# Altium schematic sheet IP5568-MCU-188-3LED-ACL-V1.0.SchDoc
size 500 x 299 mm; DocumentNumber: 5; SheetNumber: 5; SheetTotal: 8
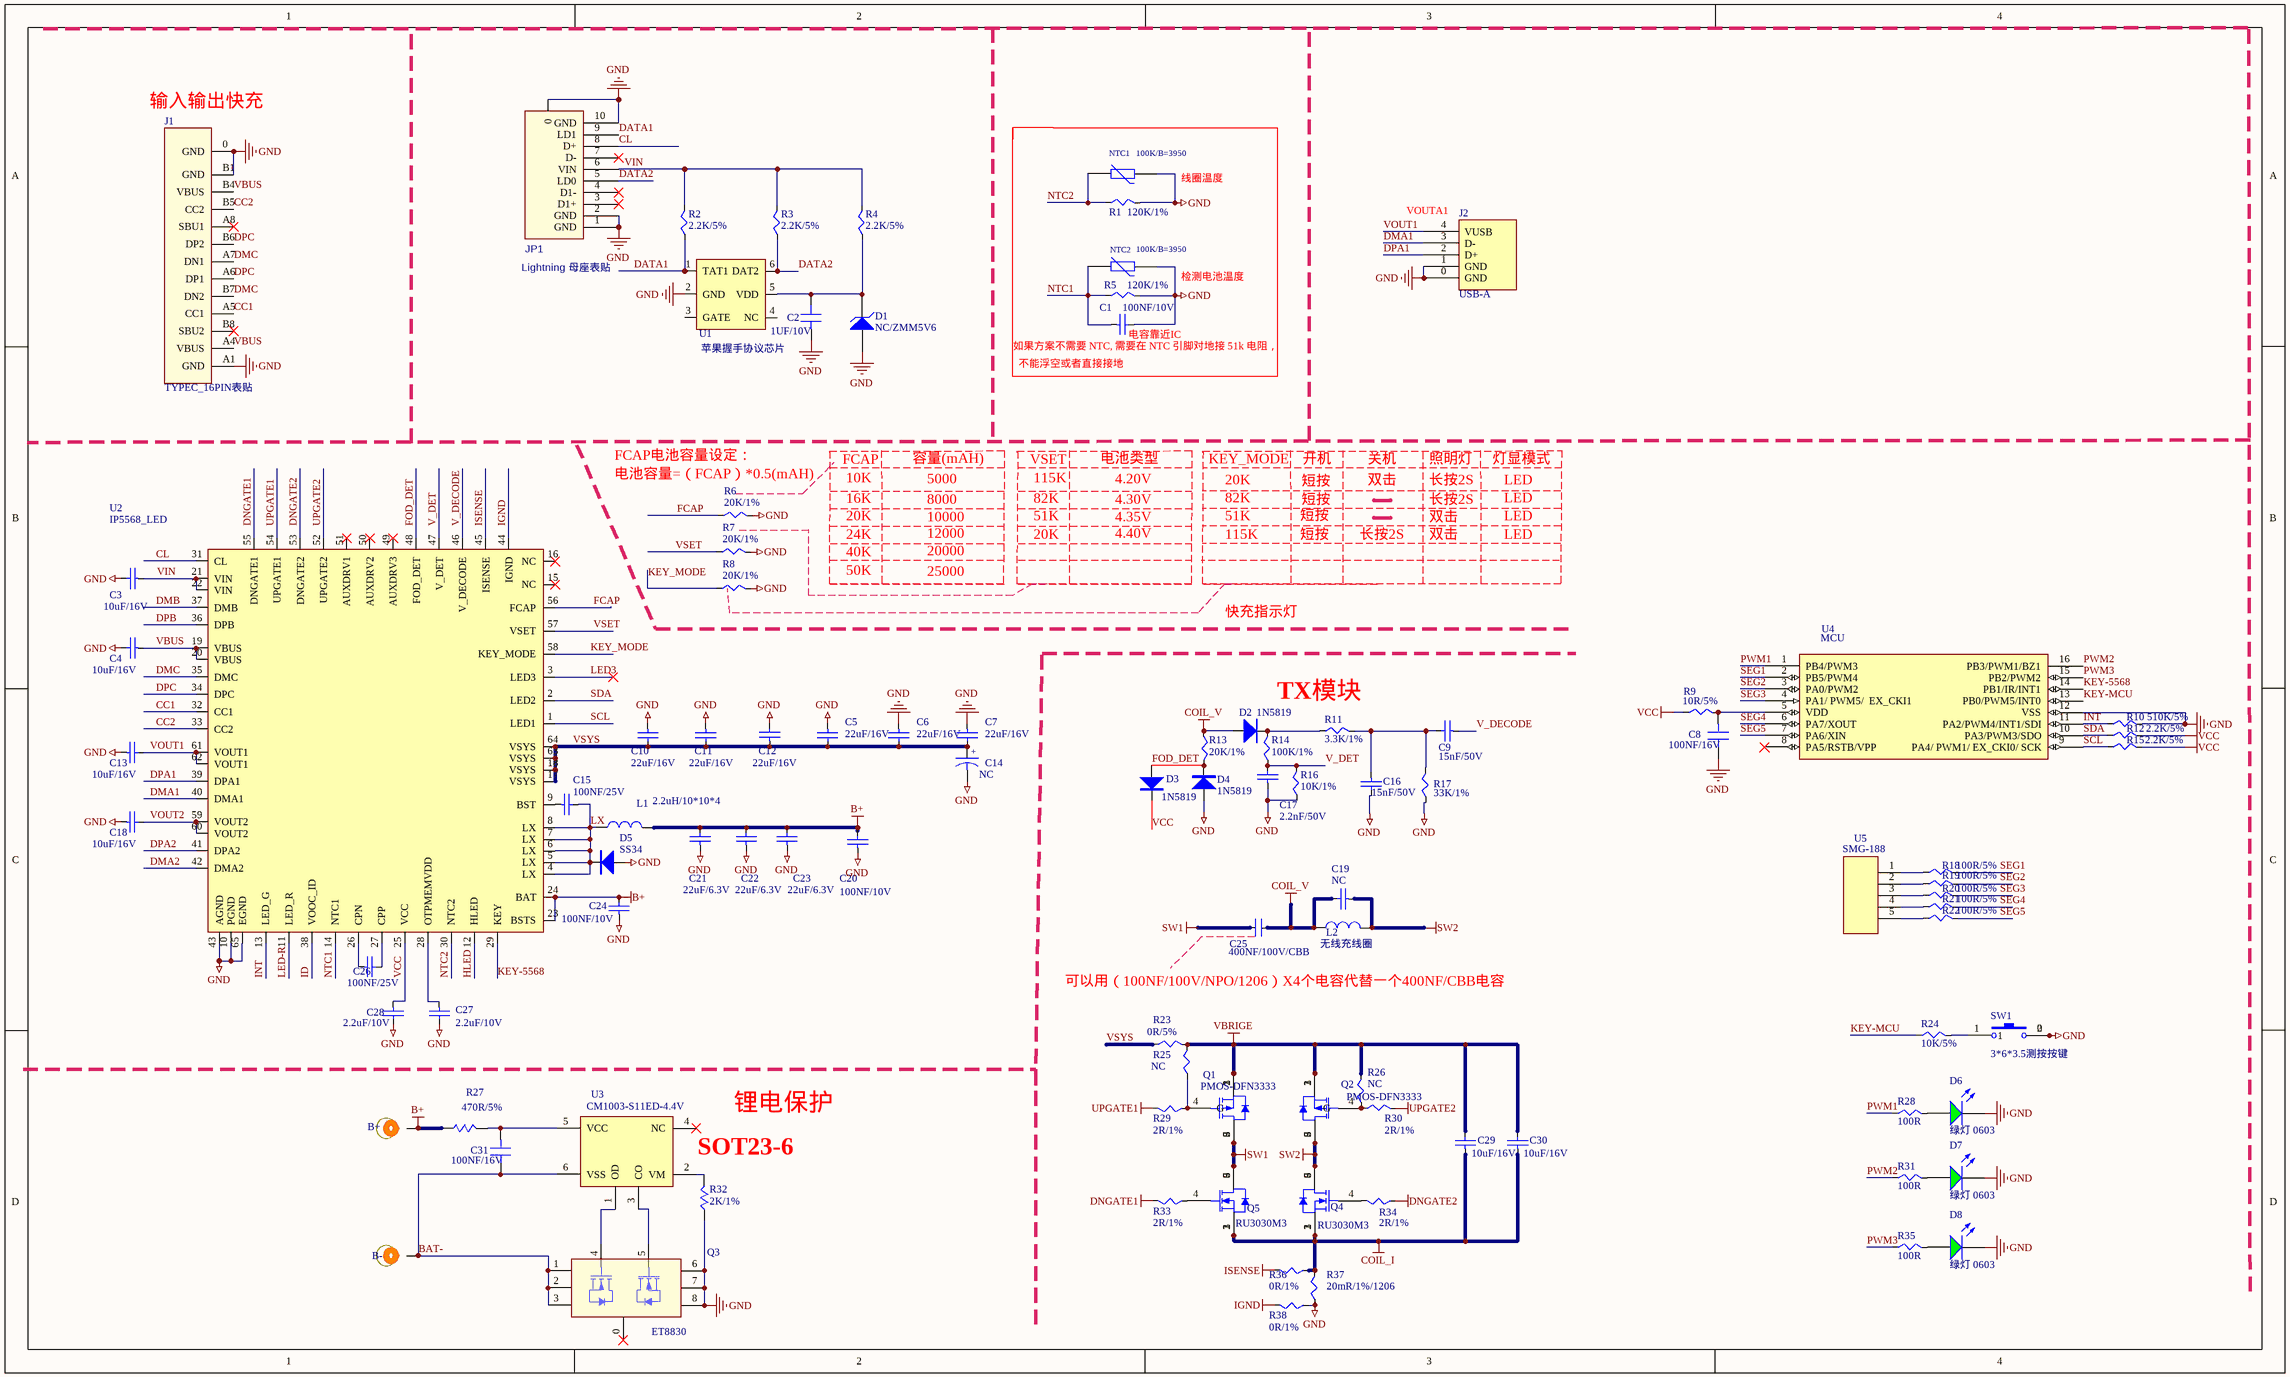
[diagram p0: IP5568-MCU-188-3LED-ACL-V1.0.SchDoc]

## Parts
B+  BAT+  [BAT-3X3]  (value not drawn)
B-  BAT-  [BAT-3X3]  (value not drawn)
C1  100NF/10V  [0402C]
C2  1UF/10V  [0402C]
C3  10uF/16V  [C0805]
C4  10uF/16V  [C0805]
C5  22uF/16V  [C0805]
C6  22uF/16V  [C0805]
C7  22uF/16V  [C0805]
C8  100NF/16V  [0402C]
C9  15nF/50V  [0402C]
C10  22uF/16V  [C0805]
C11  22uF/16V  [C0805]
C12  22uF/16V  [C0805]
C13  10uF/16V  [C0805]
C14  NC  [CAP-6.3X8-P2.5-S1]
C15  100NF/25V  [0402C]
C16  15nF/50V  [0402C]
C17  2.2nF/50V  [0402C]
C18  10uF/16V  [C0805]
C19  NC  [0402C]
C20  100NF/10V  [0402C]
C21  22uF/6.3V  [C0805]
C22  22uF/6.3V  [C0805]
C23  22uF/6.3V  [C0805]
C24  100NF/10V  [0402C]
C25  400NF/100V/CBB  [CAP-CBB-404 100V]
C26  100NF/25V  [0402C]
C27  2.2uF/10V  [0603C]
C28  2.2uF/10V  [0603C]
C29  10uF/16V  [C0805]
C30  10uF/16V  [C0805]
C31  100NF/16V  [0402C]
D1  NC/ZMM5V6  [SOD-123]
D2  1N5819  [SOD-323]
D3  1N5819  [SOD-323]
D4  1N5819  [SOD-323]
D5  SS34  [SMA]
D6  绿灯 0603  [LC-0603_LED_S1]
D7  绿灯 0603  [LC-0603_LED_S1]
D8  绿灯 0603  [LC-0603_LED_S1]
J1  TYPEC_16PIN表贴  [TYPE C 2.0-16pin 表贴]
J2  USB-A  [USB-AF8.5沉板1.9前插后贴]
JP1  Lightning 母座表贴  [Lightning_10]
L1  2.2uH/10*10*4  [L1040]
L2  无线充线圈  [2P-2.5L]
NTC1  100K/B=3950  [NTC-插件]
NTC2  100K/B=3950  [NTC-插件]
Q1  PMOS-DFN3333  [PDFN3333-8_L3.1-W3.2-P0.65-LS3.4-BL]
Q2  PMOS-DFN3333  [PDFN3333-8_L3.1-W3.2-P0.65-LS3.4-BL]
Q3  ET8830  [ET-8830-DFN3x3-8L]
Q4  RU3030M3  [PDFN3333-8_L3.1-W3.2-P0.65-LS3.4-BL]
Q5  RU3030M3  [PDFN3333-8_L3.1-W3.2-P0.65-LS3.4-BL]
R1  120K/1%  [0402R]
R2  2.2K/5%  [0402R]
R3  2.2K/5%  [0402R]
R4  2.2K/5%  [0402R]
R5  120K/1%  [0402R]
R6  20K/1%  [0402R]
R7  20K/1%  [0402R]
R8  20K/1%  [0402R]
R9  10R/5%  [0603R]
R10  510K/5%  [0402R]
R11  3.3K/1%  [0402R]
R12  2.2K/5%  [0402R]
R13  20K/1%  [0402R]
R14  100K/1%  [0402R]
R15  2.2K/5%  [0402R]
R16  10K/1%  [0402R]
R17  33K/1%  [0402R]
R18  100R/5%  [0402R]
R19  100R/5%  [0402R]
R20  100R/5%  [0402R]
R21  100R/5%  [0402R]
R22  100R/5%  [0402R]
R23  0R/5%  [0805]
R24  10K/5%  [0402R]
R25  NC  [0402R]
R26  NC  [0402R]
R27  470R/5%  [0402R]
R28  100R  [0402R]
R29  2R/1%  [0402R]
R30  2R/1%  [0402R]
R31  100R  [0402R]
R32  2K/1%  [0402R]
R33  2R/1%  [0402R]
R34  2R/1%  [0402R]
R35  100R  [0402R]
R36  0R/1%  [0402R]
R37  20mR/1%/1206  [1206]
R38  0R/1%  [0402R]
SW1  3*6*3.5测按按键  [SW-3X6X3.5mm-定位柱0.7-通孔]
U1  苹果握手协议芯片  [SOT23-6]
U2  IP5568_LED  [QFN64-8*8-0.4]
U3  CM1003-S11ED-4.4V  [SOT23-6]
U4  MCU  [SOP16L]
U5  SMG-188  [SMG-188-CYZ2342-5-75BWGD]

## Nets
B+: B+.1 C20.2 C21.2 C22.2 C23.2 C24.2 L1.2 R27.1 U2.23(BSTS) U2.24(BAT)
COIL_I: C29.1 C30.1 Q4.1(S) Q4.2(S) Q4.3(S) Q5.1(S) Q5.2(S) Q5.3(S) R36.1 R37.2
COIL_V: C19.2 C25.2 D2.A L2.1 R13.1
DNGATE1: R33.2 U2.55(DNGATE1)
DNGATE2: R34.1 U2.53(DNGATE2)
GND: C1.2 C2.1 C3.2 C4.2 C5.1 C6.1 C7.1 C8.2 C10.1 C11.1 C12.2 C13.1 C14.2 C16.2 C17.1 C18.1 C20.1 C21.1 C22.1 C23.1 C24.1 C27.2 C28.2 D1.1(A) D4.A D5.1 D6.K D7.K D8.K J1.0(GND) J1.A1(GND) J1.B1(GND) J2.0(GND) J2.1(GND) JP1.0 JP1.1(GND) JP1.2(GND) JP1.10(GND) NTC1.2 NTC2.2 Q3.6(S2) Q3.7(S2) Q3.8(S2) R1.2 R5.2 R6.2 R7.2 R8.2 R10.2 R16.1 R17.1 R32.1 R37.1 R38.1 SW1.0 SW1.2 U1.2(GND) U2.10(PGND) U2.43(AGND) U2.65(EGND) U4.12(VSS)
IGND: R38.2 U2.44(IGND)
ISENSE: R36.2 U2.45(ISENSE)
SW1: C25.1 Q1.5(D2) Q1.6(D3) Q1.7(D1) Q1.8(D1) Q1.9(D4) Q5.5(D2) Q5.6(D3) Q5.7(D1) Q5.8(D1) Q5.9(D)
SW2: C19.1 L2.2 Q2.5(D2) Q2.6(D3) Q2.7(D1) Q2.8(D1) Q2.9(D4) Q4.5(D2) Q4.6(D3) Q4.7(D1) Q4.8(D1) Q4.9(D)
UPGATE1: R29.2 U2.54(UPGATE1)
UPGATE2: R30.2 U2.52(UPGATE2)
VBRIGE: C29.2 C30.2 Q1.1(S) Q1.2(S) Q1.3(S) Q2.1(S) Q2.2(S) Q2.3(S) R23.2 R25.2 R26.2
VCC: C28.1 D3.K R9.1 R12.2 R15.2 U2.25(VCC)
BAT-: B-.1 C31.2 Q3.1(S1) Q3.2(S1) Q3.3(S1) U3.6(VSS)
CC1: J1.A5(CC1) U2.32(CC1)
CC2: J1.B5(CC2) U2.33(CC2)
CL: JP1.8(D+) U2.31(CL)
DATA1: JP1.9(LD1) R2.1 U1.1(TAT1)
DATA2: JP1.5(LD0) R3.1 U1.6(DAT2)
DMA1: J2.3(D-) U2.40(DMA1)
DMA2: U2.42(DMA2)
DMB: U2.37(DMB)
DMC: J1.A7(DN1) J1.B7(DN2) U2.35(DMC)
DPA1: J2.2(D+) U2.39(DPA1)
DPA2: U2.41(DPA2)
DPB: U2.36(DPB)
DPC: J1.A6(DP1) J1.B6(DP2) U2.34(DPC)
FCAP: R6.1 U2.56(FCAP)
FOD_DET: D3.A D4.K R13.2 U2.48(FOD_DET)
HLED: U2.12(HLED)
ID: U2.38(VOOC_ID)
INT: R10.1 U2.13(LED_G) U4.11(PA2/PWM4/INT1/SDI)
KEY-5568: U2.29(KEY) U4.14(PB1/IR/INT1)
KEY-MCU: R24.1 U4.13(PB0/PWM5/INT0)
KEY_MODE: R8.1 U2.58(KEY_MODE)
LED3: U2.3(LED3)
LED-R: U2.11(LED_R)
LX: C15.2 D5.2 L1.1 U2.4(LX) U2.5(LX) U2.6(LX) U2.7(LX) U2.8(LX)
NTC1: C1.1 NTC2.1 R5.1 U2.14(NTC1)
NTC2: NTC1.1 R1.1 U2.30(NTC2)
PWM1: R28.1 U4.1(PB4/PWM3)
PWM2: R31.1 U4.16(PB3/PWM1/BZ1)
PWM3: R35.1 U4.15(PB2/PWM2)
SCL: R15.1 U2.1(LED1) U4.9(PA4/_PWM1/_EX_CKI0/_SCK)
SDA: R12.1 U2.2(LED2) U4.10(PA3/PWM3/SDO)
SEG1: R18.2 U4.2(PB5/PWM4)
SEG2: R19.2 U4.3(PA0/PWM2)
SEG3: R20.2 U4.4(PA1/_PWM5/__EX_CKI1)
SEG4: R21.2 U4.6(PA7/XOUT)
SEG5: R22.2 U4.7(PA6/XIN)
V_DECODE: C9.1 U2.46(V_DECODE)
V_DET: C17.2 R14.1 R16.2 U2.47(V_DET)
VBUS: C4.1 J1.A4(VBUS) J1.B4(VBUS) U2.19(VBUS) U2.20(VBUS)
VIN: C3.1 JP1.6(VIN) R2.2 R3.2 R4.2 U2.21(VIN) U2.22(VIN)
VOUT1: C13.2 J2.4(VUSB) U2.61(VOUT1) U2.62(VOUT1)
VOUT2: C18.2 U2.59(VOUT2) U2.60(VOUT2)
VSET: R7.1 U2.57(VSET)
VSYS: C5.2 C6.2 C7.2 C10.2 C11.2 C12.1 C14.1 R23.1 U2.17(VSYS) U2.18(VSYS) U2.63(VSYS) U2.64(VSYS)
NetC2_2: C2.2 D1.2(K) R4.1 U1.5(VDD)
NetC8_1: C8.1 R9.2 U4.5(VDD)
NetC9_2: C9.2 C16.1 R11.2 R17.2
NetC15_1: C15.1 U2.9(BST)
NetC26_1: C26.1 U2.26(CPN)
NetC26_2: C26.2 U2.27(CPP)
NetC27_1: C27.1 U2.28(OTPMEMVDD)
NetC31_1: C31.1 R27.2 U3.5(VCC)
NetD2_K: D2.K R11.1 R14.2
NetD6_A: D6.A R28.2
NetD7_A: D7.A R31.2
NetD8_A: D8.A R35.2
NetQ1_4: Q1.4(G) R25.1 R29.1
NetQ2_4: Q2.4(G) R26.1 R30.1
NetQ3_4: Q3.4(G1) U3.1(OD)
NetQ3_5: Q3.5(G2) U3.3(CO)
NetQ4_4: Q4.4(G) R34.2
NetQ5_4: Q5.4(G) R33.1
NetR18_1: R18.1 U5.1
NetR19_1: R19.1 U5.2
NetR20_1: R20.1 U5.3
NetR21_1: R21.1 U5.4
NetR22_1: R22.1 U5.5
NetR24_2: R24.2 SW1.1
NetR32_2: R32.2 U3.2(VM)

Not connected (* = marked no-connect by the designer): J1 A8(SBU1)* B8(SBU2)*; JP1 3(D1+)* 4(D1-)* 7(D-)*; Q3 0(D1D2)*; U1 3(GATE) 4(NC); U2 15(NC)* 16(NC)* 49(AUXDRV3)* 50(AUXDRV2)* 51(AUXDRV1)*; U3 4(NC)*; U4 8(PA5/RSTB/VPP)*

## Notes on the sheet
- (near J1) 输入输出快充
- 线圈温度
- (near J2) VOUTA1
- 检测电池温度
- (near C1) 如果方案不需要 NTC, 需要在 NTC 引脚对地接 51k 电阻，
- (near C1) 电容靠近IC
- 不能浮空或者直接接地
- FCAP电池容量设定：
- FCAP
- 容量(mAH)
- VSET
- 电池类型
- KEY_MODE
- 开机
- 关机
- 照明灯
- 灯显模式
- (near R6) 电池容量=（FCAP）*0.5(mAH)
- 10K
- 16K
- 20K
- 10000
- 8000
- 5000
- 115K
- 82K
- 51K
- 4.35V
- 4.30V
- 4.20V
- 短按
- 双击
- 长按2S
- LED
- 24K
- 50K
- 40K
- 12000
- 20000
- 25000
- 4.40V
- 快充指示灯
- TX模块
- 可以用（100NF/100V/NPO/1206）X4个电容代替一个400NF/CBB电容
- SOT23-6
- 锂电保护
- (in symbol CAPACITOR POL) +

## Library data of the parts
C1 C3-C7 C9-C13 C15-C30 = CAP: Capacitor
C2 C8 C31 = CAP-0603
C14 = CAPACITOR POL: Capacitor
D1 = LL-34 ZMM5V6: 稳压二极管; ComponentLink1Description: 供应商链接; ComponentLink1URL: http://www.szlcsc.com/product/details_8541.html; Package: LL-34; Supplier: LC; SuppliersPartNumber: C8062
D2-D5 = DIODE
D6-D8 = 0603 绿灯: 发光二极管; ComponentLink1Description: 供应商链接; ComponentLink1URL: http://www.szlcsc.com/product/details_73152.html; Package: 0603; Supplier: LC; SuppliersPartNumber: C72043
J1 = TYPEC_16PIN表贴: PCB DECAL: USB-TYPEC-1
J2 = USB--A-4PIN
L1 L2 = INDUCTOR: 电感
NTC1 NTC2 = NTC: 温敏电阻
Q1 Q2 = PMOS-DFN3333_1
Q3 = NMOS-ET8830-DFN3333: NMOS-DUAL-N; Package: *
Q4 Q5 = NMOS-DFN3333
R1-R26 R28-R31 R33-R38 = RES1
R27 R32 = RES-0603
SW1 = KEY-3*6*3.5mm: 侧按按键; Published: 24-Mar-1999; LatestRevisionDate: 17-Jul-2002; LatestRevisionNote: Re-released for DXP Platform.; PackageReference: SPST-2; Publisher: Altium Limited
U1 = LP05
U2 = IP5568: 移动电源快充+无线充快充TX/RX
U3 = CM1003: 锂电保护芯片; 单价: 0.7
U4 = MCU_NY8A054E
U5 = SMG-188-YFT1508SWPGAD-5D-1